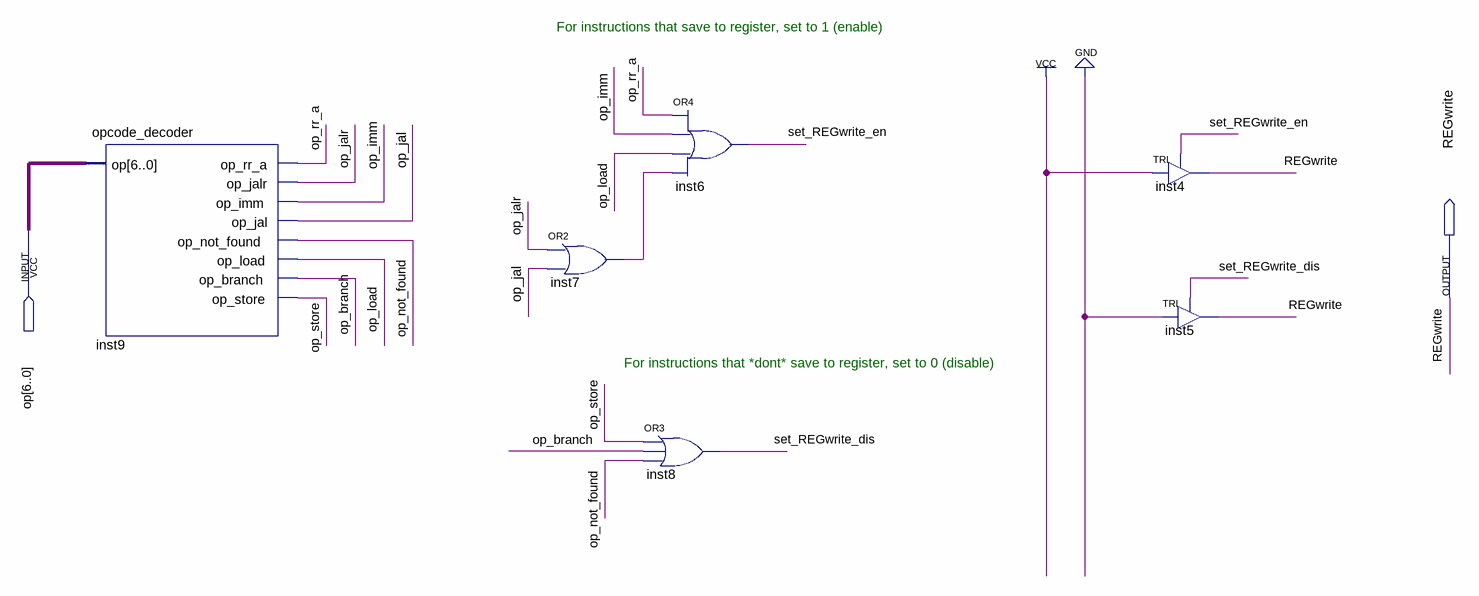
[diagram p0: schematic sheet]
// Quartus schematic REGwrite_setter.bdf as structural Verilog: 6 symbols, 2 pins
module REGwrite_setter (
  input  [6:0] op,
  output REGwrite
);

  wire inst7_out, op_branch, op_imm, op_jal, op_jalr, op_load, op_not_found, op_rr_a, op_store,
       set_REGwrite_dis, set_REGwrite_en;

  opcode_decoder inst9 (
    .op(op), .op_rr_a(op_rr_a), .op_jalr(op_jalr), .op_imm(op_imm), .op_jal(op_jal),
    .op_not_found(op_not_found), .op_load(op_load), .op_branch(op_branch), .op_store(op_store));
  or inst7 (inst7_out, op_jalr, op_jal);
  or inst8 (set_REGwrite_dis, op_store, op_branch, op_not_found);
  or inst6 (set_REGwrite_en, op_rr_a, op_imm, op_load, inst7_out);
  TRI inst4 (.IN(1'b1), .OE(set_REGwrite_en), .OUT(REGwrite));
  TRI inst5 (.IN(1'b0), .OE(set_REGwrite_dis), .OUT(REGwrite));

  // Notes on the sheet:
  //   For instructions that save to register, set to 1 (enable)
  //   For instructions that *dont* save to register, set to 0 (disable)
endmodule
